# EAGLE design Euclid_Lower (EAGLE 8.2.1)
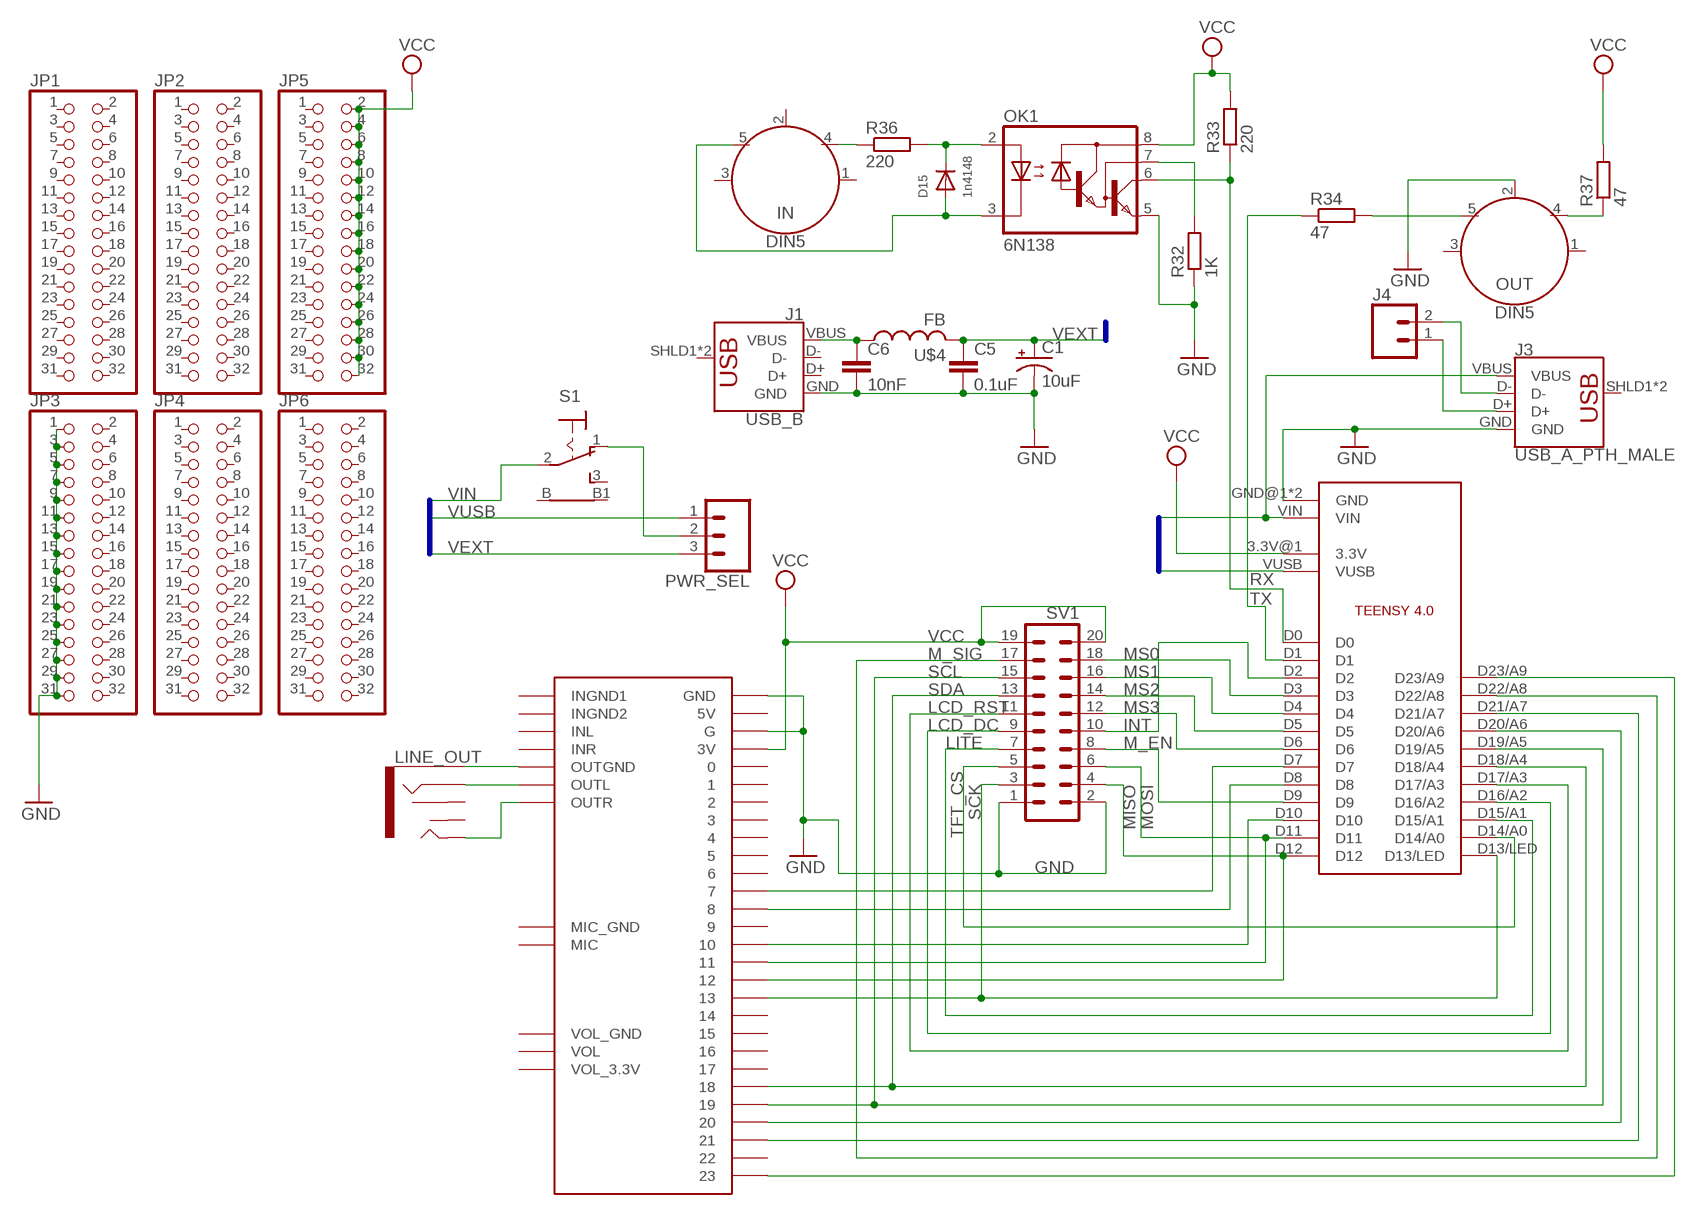
[diagram p0: schematic, sheet 1]

## Parts
C1  10uF  CPOL-USTT6D6  [TT5D6]
C5  0.1uF  C-EU025-025X050  [C025-025X050]
C6  10nF  C-EU025-025X050  [C025-025X050]
D15  1n4148  DIODEDO-1N4148  [DO-1N4148]
IN  DIN5  [DIN5-RA-PTH]
J1  USB_B  [USB-B-NO-OVERHANG]
J3  USB_A_PTH_MALE  [USB-A-H]
J4  CONN_02  [1X02]
JP1  PINHD-2X16  [2X16]
JP2  PINHD-2X16  [2X16]
JP3  PINHD-2X16  [2X16]
JP4  PINHD-2X16  [2X16]
JP5  PINHD-2X16  [2X16]
JP6  PINHD-2X16  [2X16]
LINE_OUT  AUDIO_JACK_3.5MM_KIT  [AUDIO-JACK-KIT]
OK1  6N138  [DIL08]
OUT  DIN5  [DIN5-RA-PTH]
PWR_SEL  455-1750-1-ND  CONN_03  [1X03]
R32  1K  R-EU_0207/10  [0207/10]
R33  220  R-EU_0207/10  [0207/10]
R34  47  R-EU_0207/10  [0207/10]
R36  220  R-EU_0207/10  [0207/10]
R37  47  R-EU_0207/10  [0207/10]
S1  9070-1W  [9070-1W]
SV1  MA10-2  [MA10-2]
U$1  TEENSY4.0_SIMPLE  [TEENSY4.0_SIMPLE]
U$3  AUDIOSHIELD  [AUDIOSHIELD]
U$4  FB  [FB]

## Nets
D+: J3.D+ J4.1
D-: J3.D- J4.2
GND: C1.- C5.2 C6.2 J1.GND J3.GND JP3.1 JP3.3 JP3.5 JP3.7 JP3.9 JP3.11 JP3.13 JP3.15 JP3.17 JP3.19 JP3.21 JP3.23 JP3.25 JP3.27 JP3.29 JP3.31 OK1.5(GND) OUT.2 R32.1 SV1.1 SV1.2 U$1.GND@1(GND) U$1.GND@2(GND) U$3.G U$3.GND
INT: SV1.10 U$1.D2
LCD_DC: SV1.9 U$1.D16/A2
LCD_RST: SV1.11 U$1.D17/A3
LITE: SV1.7 U$1.D15/A1
M_EN: SV1.8 U$1.D9
M_SIG: SV1.17 U$1.D22/A8
MISO: SV1.4 U$1.D12 U$3.12
MOSI: SV1.6 U$1.D11 U$3.11
MS0: SV1.18 U$1.D3
MS1: SV1.16 U$1.D4
MS2: SV1.14 U$1.D5
MS3: SV1.12 U$1.D6
N$3: U$1.D20/A6 U$3.20
N$4: U$1.D21/A7 U$3.21
N$5: U$1.D23/A9 U$3.23
N$9: U$1.D10 U$3.10
N$10: U$1.D7 U$3.7
N$11: U$1.D8 U$3.8
N$23: PWR_SEL.2 S1.1(O)
N$32: OUT.5 R34.2
N$35: OK1.7(VB) R32.2
N$36: D15.A IN.5 OK1.3(C)
N$37: D15.C OK1.2(A) R36.2
N$38: IN.4 R36.1
N$39: LINE_OUT.SLEEVE U$3.OUTGND
N$40: C6.1 J1.VBUS U$4.P$1
N$43: OUT.4 R37.1
N$44: LINE_OUT.RING U$3.OUTL
N$45: LINE_OUT.TIP U$3.OUTR
RX: OK1.6(VO) R33.1 U$1.D0
SCK: SV1.3 U$1.D13/LED U$3.13
SCL: SV1.15 U$1.D19/A5 U$3.19
SDA: SV1.13 U$1.D18/A4 U$3.18
TFT_CS: SV1.5 U$1.D14/A0
TX: R34.1 U$1.D1
VCC: JP5.2 JP5.4 JP5.6 JP5.8 JP5.10 JP5.12 JP5.14 JP5.16 JP5.18 JP5.20 JP5.22 JP5.24 JP5.26 JP5.28 JP5.30 JP5.32 OK1.8(VCC) R33.2 R37.2 SV1.19 SV1.20 U$1.3.3V@1(3.3V) U$3.3V
VEXT: C1.+ C5.1 PWR_SEL.3 U$4.P$2
VIN: J3.VBUS S1.2(P) U$1.VIN
VUSB: PWR_SEL.1 U$1.VUSB
Unconnected: IN.1 IN.2 IN.3 J1.D+ J1.D- J1.SHLD1(SHIELD) J1.SHLD2(SHIELD) J3.SHLD1(SHIELD) J3.SHLD2(SHIELD) JP1.1 JP1.2 JP1.3 JP1.4 JP1.5 JP1.6 JP1.7 JP1.8 JP1.9 JP1.10 JP1.11 JP1.12 JP1.13 JP1.14 JP1.15 JP1.16 JP1.17 JP1.18 JP1.19 JP1.20 JP1.21 JP1.22 JP1.23 JP1.24 JP1.25 JP1.26 JP1.27 JP1.28 JP1.29 JP1.30 JP1.31 JP1.32 JP2.1 JP2.2 JP2.3 JP2.4 JP2.5 JP2.6 JP2.7 JP2.8 JP2.9 JP2.10 JP2.11 JP2.12 JP2.13 JP2.14 JP2.15 JP2.16 JP2.17 JP2.18 JP2.19 JP2.20 JP2.21 JP2.22 JP2.23 JP2.24 JP2.25 JP2.26 JP2.27 JP2.28 JP2.29 JP2.30 JP2.31 JP2.32 JP3.2 JP3.4 JP3.6 JP3.8 JP3.10 JP3.12 JP3.14 JP3.16 JP3.18 JP3.20 JP3.22 JP3.24 JP3.26 JP3.28 JP3.30 JP3.32 JP4.1 JP4.2 JP4.3 JP4.4 JP4.5 JP4.6 JP4.7 JP4.8 JP4.9 JP4.10 JP4.11 JP4.12 JP4.13 JP4.14 JP4.15 JP4.16 JP4.17 JP4.18 JP4.19 JP4.20 JP4.21 JP4.22 JP4.23 JP4.24 JP4.25 JP4.26 JP4.27 JP4.28 JP4.29 JP4.30 JP4.31 JP4.32 JP5.1 JP5.3 JP5.5 JP5.7 JP5.9 JP5.11 JP5.13 JP5.15 JP5.17 JP5.19 JP5.21 JP5.23 JP5.25 JP5.27 JP5.29 JP5.31 JP6.1 JP6.2 JP6.3 JP6.4 JP6.5 JP6.6 JP6.7 JP6.8 JP6.9 JP6.10 JP6.11 JP6.12 JP6.13 JP6.14 JP6.15 JP6.16 JP6.17 JP6.18 JP6.19 JP6.20 JP6.21 JP6.22 JP6.23 JP6.24 JP6.25 JP6.26 JP6.27 JP6.28 JP6.29 JP6.30 JP6.31 JP6.32 LINE_OUT.RSH LINE_OUT.TSH OUT.1 OUT.3 S1.3(S) S1.B S1.B1 U$3.0 U$3.1 U$3.2 U$3.3 U$3.4 U$3.5 U$3.5V U$3.6 U$3.9 U$3.14 U$3.15 U$3.16 U$3.17 U$3.22 U$3.GND_MIC(MIC_GND) U$3.INGND1 U$3.INGND2 U$3.INL U$3.INR U$3.MIC U$3.VOL U$3.VOL_3.3V U$3.VOL_GND

## Buses
VIN,VUSB,VEXT

## Library data of the parts
C1 = rcl:CPOL-US: POLARIZED CAPACITOR, American symbol
C5 C6 = resistor:C-EU: CAPACITOR, European symbol
D15 = adafruit:DIODE: Diode SMADIODE - SMA Surface Mount Package 20V 1A Schottky Diode Digikey: 641-1014-6-ND DO-1N4148 - Through Hole Small Current Diode SOD-123 20V 1 A (.5mV Vf) Schottky Diode - Digikey: MBRX120TPMSCT-ND SOD-323 10V 570mA (.38mV Vf, 3ns) Schottky Diode - Digikey: ZLLS410CT-ND SOD-523 30V 30mA Schottky Diode (RB751S-40TE61) - Digikey: RB751S-40TE61CT-ND SOT23-R/W - SOT23 Package (R = Solder Paste/Reflow Ovens, W = Hand-Soldering) BAT54Film 40V 300mA - Digikey: 497-7162-1-ND
IN OUT = SparkFun-Connectors:DIN5: DIN5 Connector - Female Right Angle (frequently used as a MIDI Jack connector) This type of connector and cable is frequently used for transmitting midi data (musical instrument digital interface). It is what you usually see on a keyboard or set of electronic drums. Learn more here <https://en.wikipedia.org/wiki/MIDI>. For more information on the pinout and electrical specifications of MIDI communications, please see the following resource: https://www.midi.org/specifications/item/midi-din-electrical-specification Here is the connector we sell at SparkFun: MIDI Connector - Female Right Angle <https://www.sparkfun.com/products/9536> (PRT-09536) Datasheet <hhttp://www.sparkfun.com/datasheets/Prototyping/Connectors/MIDI-RA.pdf> It is used on this SparkFun product: SparkFun MIDI Shield <https://www.sparkfun.com/products/12898> (DEV-12898); PROD_ID: CONN-09481
J1 = SparkFun-Connectors:USB_B: USB Type B Connector SparkFun Products: SparkFun Stepoko <https://www.sparkfun.com/products/13899> PTH
J3 = SparkFun-Connectors:USB_A: USB-A Connector Male and female variants, as well as PTH and SMT variants SparkFun Products: SparkFun XBee Explorer Dongle <https://www.sparkfun.com/products/11697> PTH Male SparkFun MicroView-USB Programmer <https://www.sparkfun.com/products/12924> SMT Male SparkFun USB Type A Female Breakout <https://www.sparkfun.com/products/12700> SMT Female; PROD_ID: CONN-08367; SF_ID: PRT-00437
J4 = SparkFun-Connectors:CONN_02: Multi connection point. Often used as Generic Header-pin footprint for 0.1 inch spaced/style header connections On any of the 0.1 inch spaced packages, you can populate with these: Break Away Headers - Straight <https://www.sparkfun.com/products/116> (PRT-00116) Break Away Male Headers - Right Angle <https://www.sparkfun.com/products/553> (PRT-00553) Female Headers <https://www.sparkfun.com/products/115> (PRT-00115) Break Away Headers - Machine Pin <https://www.sparkfun.com/products/117> (PRT-00117) Break Away Female Headers - Swiss Machine Pin <https://www.sparkfun.com/products/743> (PRT-00743) For SCREWTERMINALS and SPRING TERMINALS visit here: Screw Terimnals on SparkFun.com <https://www.sparkfun.com/search/results?term=Screw+Terminals> (5mm/3.5mm/2.54mm spacing) This device is also useful as a general connection point to wire up your design to another part of your project. Our various solder wires solder well into these plated through hole pads. Hook-Up Wire - Assortment (Stranded, 22 AWG) <https://www.sparkfun.com/products/11375> (PRT-11375) Hook-Up Wire - Assortment (Solid Core, 22 AWG) <https://www.sparkfun.com/products/11367> (PRT-11367) View the entire wire category on our website here <https://www.sparkfun.com/categories/141> Special notes: Molex polarized connector foot print use with: PRT-08233 with associated crimp pins and housings. 2.54_SCREWTERM for use with PRT-10571. 3.5mm Screw Terminal footprints for PRT-08084 5mm Screw Terminal footprints for use with PRT-08432
JP1-JP6 = pinhead:PINHD-2X16: PIN HEADER
LINE_OUT = SparkFun-Connectors:AUDIO_JACK_3.5MM: Audio Jack 3.5mm variants of PTH and SMT stereo audio jack with bypass switches. SparkFun Products: SparkFun SparkPunk Sound Kit <[https://www.sparkfun.com/products/11177]> - PTH MP3 Trigger <https://www.sparkfun.com/products/13720> -3.5mm SMD SparkFun PicoBoard <https://www.sparkfun.com/products/11888>- 2.5mm SMD; PROD_ID: CONN-08774; SF_ID: PRT-08032
OK1 = optocoupler:6N138: MOTOROLA OPTO COUPLER; MF: VISHAY/TELEFUNKEN; MPN: 6N138; OC_FARNELL: 9860150; OC_NEWARK: 35K5294
PWR_SEL = SparkFun-Connectors:CONN_03: Multi connection point. Often used as Generic Header-pin footprint for 0.1 inch spaced/style header connections On any of the 0.1 inch spaced packages, you can populate with these: Break Away Headers - Straight <https://www.sparkfun.com/products/116> (PRT-00116) Break Away Male Headers - Right Angle <https://www.sparkfun.com/products/553> (PRT-00553) Female Headers <https://www.sparkfun.com/products/115> (PRT-00115) Break Away Headers - Machine Pin <https://www.sparkfun.com/products/117> (PRT-00117) Break Away Female Headers - Swiss Machine Pin <https://www.sparkfun.com/products/743> (PRT-00743) Stackable Header - 3 Pin (Female, 0.1") <https://www.sparkfun.com/products/13875> (PRT-13875) For SCREWTERMINALS and SPRING TERMINALS visit here: Screw Terimnals on SparkFun.com <https://www.sparkfun.com/search/results?term=Screw+Terminals> (5mm/3.5mm/2.54mm spacing) This device is also useful as a general connection point to wire up your design to another part of your project. Our various solder wires solder well into these plated through hole pads. Hook-Up Wire - Assortment (Stranded, 22 AWG) <https://www.sparkfun.com/products/11375> (PRT-11375) Hook-Up Wire - Assortment (Solid Core, 22 AWG) <https://www.sparkfun.com/products/11367> (PRT-11367) View the entire wire category on our website here <https://www.sparkfun.com/categories/141> Special notes: Molex polarized connector foot print use with SKU : PRT-08232 with associated crimp pins and housings.; PROD_ID: XXX-00000
R32-R34 R36 R37 = resistor:R-EU_: RESISTOR, European symbol
S1 = switch:9070-1W: TOGGLE SWITCH Marquardt
SV1 = con-lstb:MA10-2: PIN HEADER; OC_FARNELL: unknown; OC_NEWARK: unknown
U$1 = Teensy4.0_SIMPLE:TEENSY4.0_SIMPLE
U$3 = Teensy_Audioshield_alt:AUDIOSHIELD: Teensy 3 Audioshield by PJRC.COM
U$4 = adafruit:FB: Ferrite bead Digikey #P9821BK-ND

## Board
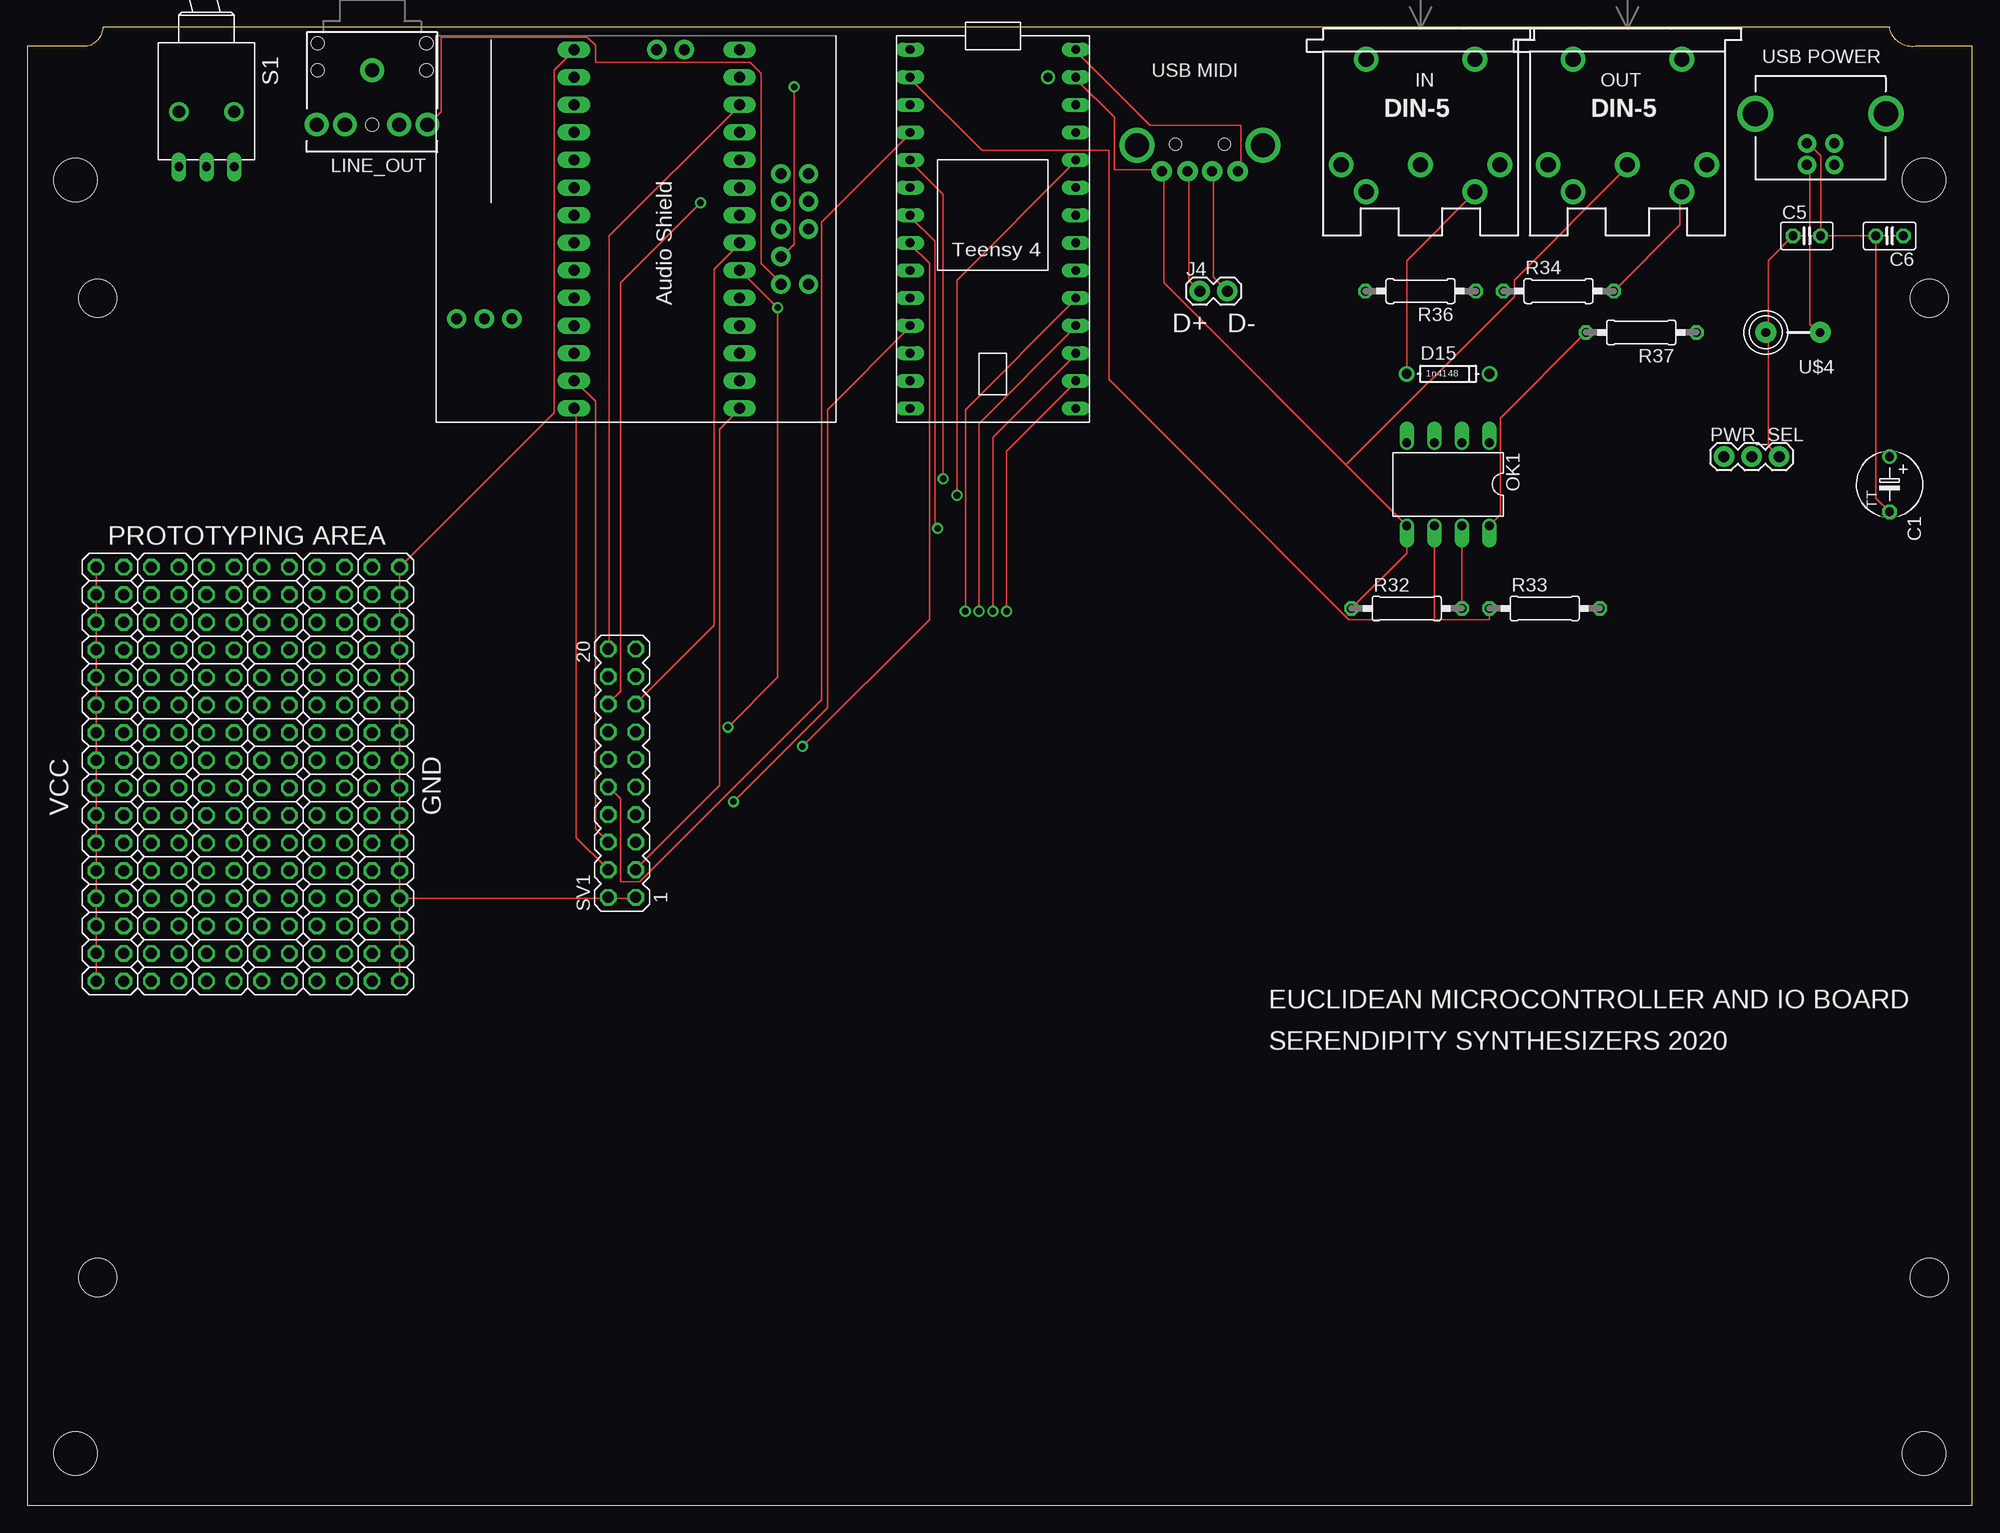
[diagram p1: board, top side]
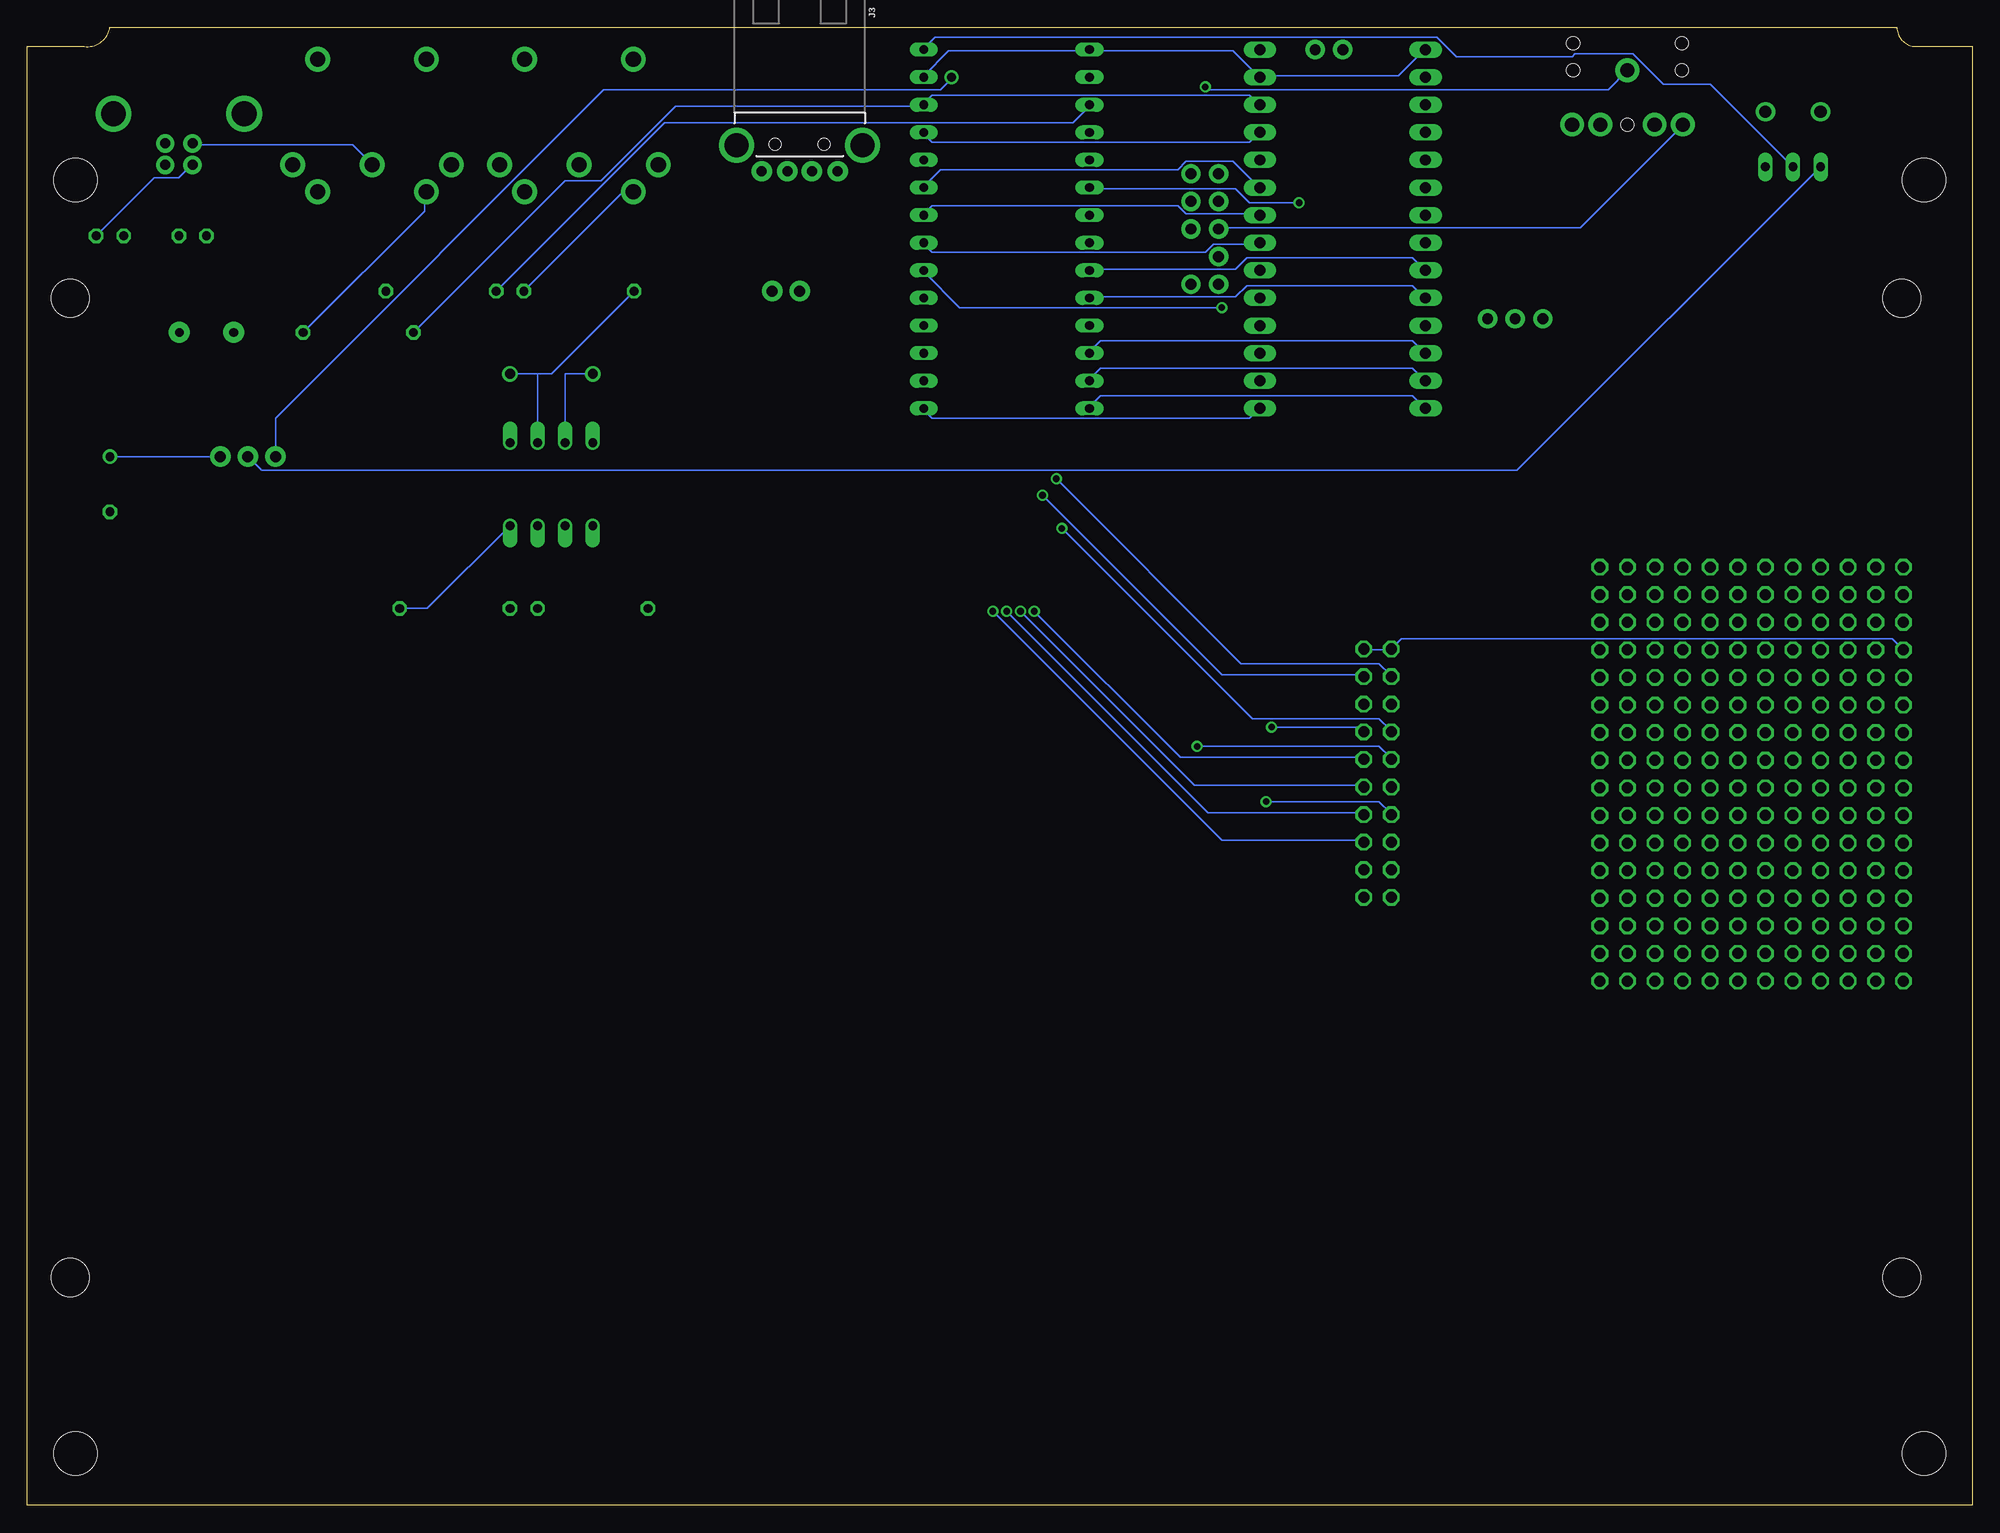
[diagram p2: board, bottom side, seen from below]

Size 179.07 x 136.05 mm. Coordinates in mm from the lower left corner, seen from the top.
Outline: 6.99,136.05 171.45,136.05 arc90 173.83,134.28 179.07,134.28 179.07,0 0,0 0,134.28 5.2,134.28 arc90 6.95,136.05
Copper layers (1*16): Top 0.035mm / dielectric 1.5mm / Bottom 0.035mm
Design rules "default": minimum track width 6mil, minimum drill 24mil, track to track 6mil, track to pad 6mil, pad to pad 6mil, via to via 6mil, smd to smd 6mil, copper to edge 32mil, drill to drill 6mil, minimum pad ring 10mil, minimum via ring 8mil, stop-mask expansion 4mil, vias tented up to drill 0mil, thermal gap 10mil
Holes 4 mm at 4.45,4.76 174.63,4.76 4.45,121.98 174.63,121.98
Holes 3.5 mm at 6.5,20.97 175.11,20.97 175.11,111.1 6.5,111.1
tRestrict: area 108.7,123.9 to 111.7,126.9; area 104.2,123.9 to 107.2,126.9; area 35.9,133.7 to 37.8,135.6; area 25.7,133.7 to 27.6,135.6; area 35.9,131.1 to 37.8,133; area 25.7,131.1 to 27.6,133
bRestrict: area 108.7,123.9 to 111.7,126.9; area 104.2,123.9 to 107.2,126.9; area 35.9,133.7 to 37.8,135.6; area 25.7,133.7 to 27.6,135.6; area 35.9,131.1 to 37.8,133; area 25.7,131.1 to 27.6,133

### Footprints (pad centres in the part's own frame; a part is rotated, then mirrored left to right if it is on the bottom)
TT5D6 = drill 0.813: + -2.54,0 | drill 0.813 octagon: - 2.54,0
C025-025X050 = drill 0.813 octagon: 1 -1.27,0; 2 1.27,0
DO-1N4148 = drill 0.9: A -3.81,0; C 3.81,0
DIN5-RA-PTH = drill 1.4 pad 2.286: 1 7.3,12.5; 2 0,12.5; 3 -7.3,12.5; 4 5,15; 5 -5,15; 6 -5,2.8; 7 5,2.8
USB-B-NO-OVERHANG = drill 0.914 pad 1.676: D+ 4,1.25; D- 5.981,1.25; GND 4,-1.25; VBUS 5.981,-1.25 | drill 2.286: SHLD1 1.282,-6.02; SHLD2 1.282,6.02
USB-A-H = drill 0.914 pad 1.88: D+ 2.4,1.127; D- 2.4,-1.127; GND 2.4,3.5; VBUS 2.4,-3.5 | drill 2.2: SHLD1 0,-5.8; SHLD2 0,5.8 | hole 1.1: -0.1,2.25; -0.1,-2.25
1X02 = drill 1.016 pad 1.88: 1 0,0; 2 2.54,0
2X16 = drill 1.016 octagon: 1 -19.05,-1.27; 2 -19.05,1.27; 3 -16.51,-1.27; 4 -16.51,1.27; 5 -13.97,-1.27; 6 -13.97,1.27; 7 -11.43,-1.27; 8 -11.43,1.27; 9 -8.89,-1.27; 10 -8.89,1.27; 11 -6.35,-1.27; 12 -6.35,1.27; 13 -3.81,-1.27; 14 -3.81,1.27; 15 -1.27,-1.27; 16 -1.27,1.27; 17 1.27,-1.27; 18 1.27,1.27; 19 3.81,-1.27; 20 3.81,1.27; 21 6.35,-1.27; 22 6.35,1.27; 23 8.89,-1.27; 24 8.89,1.27; 25 11.43,-1.27; 26 11.43,1.27; 27 13.97,-1.27; 28 13.97,1.27; 29 16.51,-1.27; 30 16.51,1.27; 31 19.05,-1.27; 32 19.05,1.27
AUDIO-JACK-KIT = drill 1.3 pad 2.184: RING 5,5.1; RSH 5,2.5; SLEEVE 0,0; TIP 5,-5.1; TSH 5,-2.5 | hole 1.2: 0,5; -2.5,5; -2.5,-5; 0,-5; 5,0
DIL08 = drill 0.813 offset: 1 -3.81,-3.81; 2 -1.27,-3.81; 3 1.27,-3.81; 4 3.81,-3.81; 5 3.81,3.81; 6 1.27,3.81; 7 -1.27,3.81; 8 -3.81,3.81
1X03 = drill 1.016 pad 1.88: 1 0,0; 2 2.54,0; 3 5.08,0
0207/10 = drill 0.813 octagon: 1 -5.08,0; 2 5.08,0
9070-1W = drill 0.813 long: 1 5.08,-2.54; 2 5.08,0; 3 5.08,2.54 | drill 1.118 pad 1.778: B 0,-2.54; B1 0,2.54
MA10-2 = drill 1.016 octagon: 1 -11.43,-1.27; 2 -11.43,1.27; 3 -8.89,-1.27; 4 -8.89,1.27; 5 -6.35,-1.27; 6 -6.35,1.27; 7 -3.81,-1.27; 8 -3.81,1.27; 9 -1.27,-1.27; 10 -1.27,1.27; 11 1.27,-1.27; 12 1.27,1.27; 13 3.81,-1.27; 14 3.81,1.27; 15 6.35,-1.27; 16 6.35,1.27; 17 8.89,-1.27; 18 8.89,1.27; 19 11.43,-1.27; 20 11.43,1.27
TEENSY4.0_SIMPLE = drill 0.8 long: 3.3V@1 7.62,10.16; D0 -7.62,12.7; D1 -7.62,10.16; D2 -7.62,7.62; D3 -7.62,5.08; D4 -7.62,2.54; D5 -7.62,0; D6 -7.62,-2.54; D7 -7.62,-5.08; D8 -7.62,-7.62; D9 -7.62,-10.16; D10 -7.62,-12.7; D11 -7.62,-15.24; D12 -7.62,-17.78; D13/LED 7.62,-17.78; D14/A0 7.62,-15.24; D15/A1 7.62,-12.7; D16/A2 7.62,-10.16; D17/A3 7.62,-7.62; D18/A4 7.62,-5.08; D19/A5 7.62,-2.54; D20/A6 7.62,0; D21/A7 7.62,2.54; D22/A8 7.62,5.08; D23/A9 7.62,7.62; GND@1 -7.62,15.24; GND@2 7.62,12.7; VIN 7.62,15.24 | drill 0.8: VUSB 5.08,12.7
AUDIOSHIELD = drill 1 long: 0 -13.97,-5.08; 1 -11.43,-5.08; 2 -8.89,-5.08; 3 -6.35,-5.08; 3V -11.43,10.16; 4 -3.81,-5.08; 5 -1.27,-5.08; 5V -16.51,10.16; 6 1.27,-5.08; 7 3.81,-5.08; 8 6.35,-5.08; 9 8.89,-5.08; 10 11.43,-5.08; 11 13.97,-5.08; 12 16.51,-5.08; 13 16.51,10.16; 14 13.97,10.16; 15 11.43,10.16; 16 8.89,10.16; 17 6.35,10.16; 18 3.81,10.16; 19 1.27,10.16; 20 -1.27,10.16; 21 -3.81,10.16; 22 -6.35,10.16; 23 -8.89,10.16; G -13.97,10.16; GND -16.51,-5.08 | drill 1 pad 1.778: GND_MIC -16.51,2.54; INGND1 -5.08,16.51; INGND2 -2.54,16.51; INL -5.08,13.97; INR -2.54,13.97; MIC -16.51,5.08; OUTGND 2.54,13.97; OUTL 5.08,13.97; OUTR 0,13.97; UNUSED1 0,16.51; UNUSED2 5.08,16.51; VOL 8.255,-13.335; VOL_3.3V 8.255,-15.875; VOL_GND 8.255,-10.795
FB = drill 0.8 pad 1.93: P$1 -2.5,0; P$2 2.5,0

### Placement (x,y rotation side)
C1  171.45,93.98 270 top
C5  163.83,116.84 0 top
C6  171.45,116.84 180 top
D15  130.81,104.14 0 top
IN  128.27,135.89 180 top
J1  165.1,129.35 270 top
J3  107.95,125.19 270 bottom
J4  107.95,111.76 0 top
JP1  27.94,67.31 90 top
JP2  17.78,67.31 90 top
JP3  33.02,67.31 90 top
JP4  22.86,67.31 90 top
JP5  7.62,67.31 90 top
JP6  12.7,67.31 90 top
LINE_OUT  31.75,132.08 270 top
OK1  130.81,93.98 180 top
OUT  147.32,135.89 180 top
PWR_SEL  156.21,96.52 0 top
R32  127,82.55 0 top
R33  139.7,82.55 0 top
R34  140.97,111.76 0 top
R36  128.27,111.76 180 top
R37  148.59,107.95 180 top
S1  16.51,128.27 270 top
SV1  54.76,67.39 90 top
U$1  88.9,118.75 0 top
U$3  55.42,117.47 270 top
U$4  162.56,107.95 180 top

### Tracks (layer width: path | path; a pad name or v marks a point on that pad's centre or on a via)
D+
  Top 0.152: J4.1 106.93,112.78 106.93,122.68 J3.D+
D-
  Top 0.152: J4.2 109.22,113.03 109.22,122.68 J3.D-
GND
  Top 0.152: SV1.1 55.88,55.88 53.59,55.88 SV1.2 53.34,55.88 JP3.7 | JP3.1 JP3.3 JP3.5 JP3.7 | JP3.7 JP3.9 JP3.11 JP3.13 JP3.15 JP3.17 JP3.19 JP3.21 JP3.23 JP3.25 JP3.27 JP3.29 JP3.31 48.51,100.58 48.51,132.08 50.29,133.86 U$3.GND | 163.83,125.48 J1.GND 164.08,125.22 165.1,124.21 C5.2 C6.2 170.18,92.71 C1.- | R32.1 127,87.63 OK1.5 121.41,95.76 | U$1.GND@2 96.52,131.32 100.08,127.76 100.08,122.94 104.39,122.94 J3.GND 104.65,122.68 104.65,112.52 121.41,95.76 | 121.41,95.76 136.91,111.25 136.91,112.78 147.32,123.19 OUT.2
  Bottom 0.152: OUT.2 147.32,123.44 149.1,125.22 163.83,125.22 J1.GND | 81.28,133.86 94.23,133.86 96.52,131.57 U$1.GND@2 | 81.28,133.86 68.07,133.86 65.79,131.57 U$3.G 65.53,131.57 52.83,131.57 50.55,133.86 U$3.GND | 81.28,133.86 U$1.GND@1
INT
  Top 0.152: U$1.D2 81.28,126.24 73.15,118.11 73.15,74.17 56.39,57.4 54.61,57.4 54.61,65.02 53.59,66.04 SV1.10
LCD_DC  (via drill 0.61)
  Top 0.152: v87.63,82.3 87.63,99.57 96.52,108.46 U$1.D16/A2
  Bottom 0.152: v87.63,82.3 71.63,66.29 56.13,66.29 SV1.9
LCD_RST  (via drill 0.61)
  Top 0.152: v86.36,82.3 86.36,100.84 96.52,111 U$1.D17/A3
  Bottom 0.152: v86.36,82.3 72.9,68.83 56.13,68.83 SV1.11
LITE  (via drill 0.61)
  Top 0.152: v88.9,82.3 88.9,98.3 96.52,105.92 U$1.D15/A1
  Bottom 0.152: v88.9,82.3 70.36,63.75 56.13,63.75 SV1.7
M_EN  (via drill 0.61)
  Top 0.152: v65.02,64.77 73.66,73.41 73.66,100.84 81.28,108.46 U$1.D9
  Bottom 0.152: v65.02,64.77 54.61,64.77 53.59,63.75 SV1.8
M_SIG  (via drill 0.61)
  Top 0.152: v85.6,92.96 85.6,112.78 96.52,123.7 U$1.D22/A8
  Bottom 0.152: v85.6,92.96 69.09,76.45 56.13,76.45 SV1.17
MISO
  Top 0.152: SV1.4 53.34,58.67 50.55,61.47 50.55,100.84 U$3.12
  Bottom 0.152: U$1.D12 81.28,101.09 80.26,102.11 51.56,102.11 50.55,101.09 U$3.12
MOSI
  Top 0.152: SV1.6 53.34,61.21 52.32,62.23 52.32,101.6 50.55,103.38 U$3.11
  Bottom 0.152: U$1.D11 81.28,103.63 80.26,104.65 51.56,104.65 50.55,103.63 U$3.11
MS0  (via drill 0.61)
  Top 0.152: v84.33,94.49 84.33,120.65 81.28,123.7 U$1.D3
  Bottom 0.152: v84.33,94.49 67.31,77.47 54.61,77.47 53.59,76.45 SV1.18
MS1  (via drill 0.61)
  Top 0.152: v61.98,119.89 54.61,112.52 54.61,74.93 53.59,73.91 SV1.16
  Bottom 0.152: v61.98,119.89 66.55,119.89 67.82,121.16 81.28,121.16 U$1.D4
MS2  (via drill 0.61)
  Top 0.152: v83.82,89.92 83.57,90.17 83.57,116.33 81.28,118.62 U$1.D5
  Bottom 0.152: v83.82,89.92 66.29,72.39 54.61,72.39 53.59,71.37 SV1.14
MS3  (via drill 0.61)
  Top 0.152: v71.37,69.85 83.06,81.53 83.06,114.3 81.28,116.08 U$1.D6
  Bottom 0.152: v71.37,69.85 54.61,69.85 53.59,68.83 SV1.12
N$3
  Bottom 0.152: U$1.D20/A6 96.52,118.87 95.76,119.63 73.15,119.63 72.39,118.87 65.79,118.87 U$3.20
N$4
  Bottom 0.152: U$1.D21/A7 96.52,121.41 95,122.94 73.15,122.94 72.39,123.7 68.07,123.7 65.79,121.41 U$3.21
N$5
  Bottom 0.152: U$1.D23/A9 96.52,126.24 95.76,125.48 66.55,125.48 65.79,126.24 U$3.23
N$9
  Bottom 0.152: U$1.D10 81.28,106.17 80.26,107.19 51.56,107.19 50.55,106.17 U$3.10
N$10
  Bottom 0.152: U$1.D7 81.28,113.79 67.82,113.79 66.8,114.81 51.56,114.81 50.55,113.79 U$3.7
N$11
  Bottom 0.152: U$1.D8 81.28,111.25 67.82,111.25 66.8,112.27 51.56,112.27 50.55,111.25 U$3.8
N$23
  Bottom 0.152: S1.1 41.91,95.25 157.48,95.25 PWR_SEL.2
N$32
  Top 0.152: R34.2 152.15,117.86 152.15,120.65 OUT.5
N$35
  Top 0.152: OK1.7 R32.2
N$36
  Top 0.152: D15.A 127,114.55 133.1,120.65 IN.5
  Bottom 0.152: OK1.3 129.54,104.14 D15.A
N$37
  Bottom 0.152: 132.08,104.14 OK1.2 | D15.C 132.08,104.14 | R36.2 130.81,104.14 132.08,104.14
N$38
  Bottom 0.152: R36.1 124.46,120.65 123.44,120.65 IN.4
N$39  (via drill 0.61)
  Top 0.152: v70.61,130.56 70.61,116.08 69.6,115.06 U$3.OUTGND
  Bottom 0.152: v70.61,130.56 70.36,130.3 33.53,130.3 LINE_OUT.SLEEVE
N$40
  Top 0.152: U$4.P$1 164.85,107.95 164.08,108.71 164.08,123.19 J1.VBUS
  Bottom 0.152: C6.1 167.39,122.17 165.1,122.17 164.08,123.19 J1.VBUS
N$43
  Bottom 0.152: R37.1 142.49,119.13 142.49,120.65 OUT.4
N$44
  Top 0.152: U$3.OUTL 69.34,112.52 67.56,114.3 67.56,131.83 66.55,132.84 52.32,132.84 52.32,134.37 51.56,135.13 38.1,135.13 38.1,128.27 37.08,127.25 LINE_OUT.RING
N$45
  Bottom 0.152: U$3.OUTR 69.34,117.6 36.07,117.6 26.67,127 LINE_OUT.TIP
RX
  Top 0.152: 129.54,81.53 134.62,81.53 R33.1 | 129.54,81.53 121.67,81.53 99.57,103.63 99.57,124.71 87.88,124.71 81.28,131.32 U$1.D0 | 129.54,81.53 OK1.6
SCK
  Top 0.152: SV1.3 56.13,58.67 63.75,66.29 63.75,99.06 65.53,100.84 U$3.13
  Bottom 0.152: U$1.D13/LED 96.52,100.84 95.76,100.08 66.55,100.08 65.79,100.84 U$3.13
SCL
  Top 0.152: SV1.15 56.13,73.91 63.25,81.03 63.25,113.79 65.53,116.08 U$3.19
  Bottom 0.152: U$1.D19/A5 96.52,116.08 95.76,115.32 70.61,115.32 69.85,116.08 65.79,116.08 U$3.19
SDA  (via drill 0.61)
  Top 0.152: U$3.18 65.79,113.54 v69.09,110.24 69.09,76.2 v64.52,71.63
  Bottom 0.152: v69.09,110.24 93.22,110.24 96.52,113.54 U$1.D18/A4 | v64.52,71.63 56.39,71.63 56.13,71.37 SV1.13
TFT_CS  (via drill 0.61)
  Top 0.152: v90.17,82.3 90.17,97.03 96.52,103.38 U$1.D14/A0
  Bottom 0.152: v90.17,82.3 69.09,61.21 56.13,61.21 SV1.5
TX
  Bottom 0.152: R34.1 120.4,127.25 82.8,127.25 81.28,128.78 U$1.D1
VCC
  Top 0.152: R37.2 135.64,100.08 135.64,91.19 OK1.8 | JP5.32 JP5.30 JP5.28 JP5.26 JP5.24 JP5.22 JP5.20 JP5.18 JP5.16 JP5.14 JP5.12 JP5.10 JP5.8 JP5.6 JP5.4 JP5.2 | U$3.3V 65.53,128.78 53.59,116.84 53.59,78.99 SV1.20
  Bottom 0.152: OK1.8 142.24,82.55 R33.2 | U$3.3V 65.79,129.03 66.55,129.79 95.76,129.79 96.52,129.03 U$1.3.3V@1 96.52,128.78 119.38,128.78 126.24,121.92 129.54,121.92 R37.2 | SV1.19 55.88,78.74 53.59,78.74 SV1.20 53.34,78.99 52.58,79.76 7.37,79.76 JP5.26
VEXT
  Top 0.152: C5.1 160.27,114.55 160.27,107.95 | PWR_SEL.3 160.27,97.54 160.27,107.95 | 160.27,107.95 U$4.P$2
  Bottom 0.152: PWR_SEL.3 C1.+
VIN
  Top 0.152: U$1.VIN 96.52,133.86 103.38,127 111.76,127 111.76,123.19 111.51,122.94 J3.VBUS
  Bottom 0.152: S1.2 24.13,130.81 28.45,130.81 31.24,133.6 36.58,133.6 36.83,133.35 47.5,133.35 49.28,135.13 95.5,135.13 96.52,134.11 U$1.VIN
VUSB
  Bottom 0.152: PWR_SEL.1 156.21,100.08 125.98,130.3 95,130.3 93.98,131.32 U$1.VUSB

### Text on the board
tNames: USB POWER | USB MIDI | D+ | D- | PROTOTYPING AREA | VCC | GND | EUCLIDEAN MICROCONTROLLER AND IO BOARD | SERENDIPITY SYNTHESIZERS 2020